# Altium project NXP_FRDM_IMX93.PrjPcb (part 13 of 13)
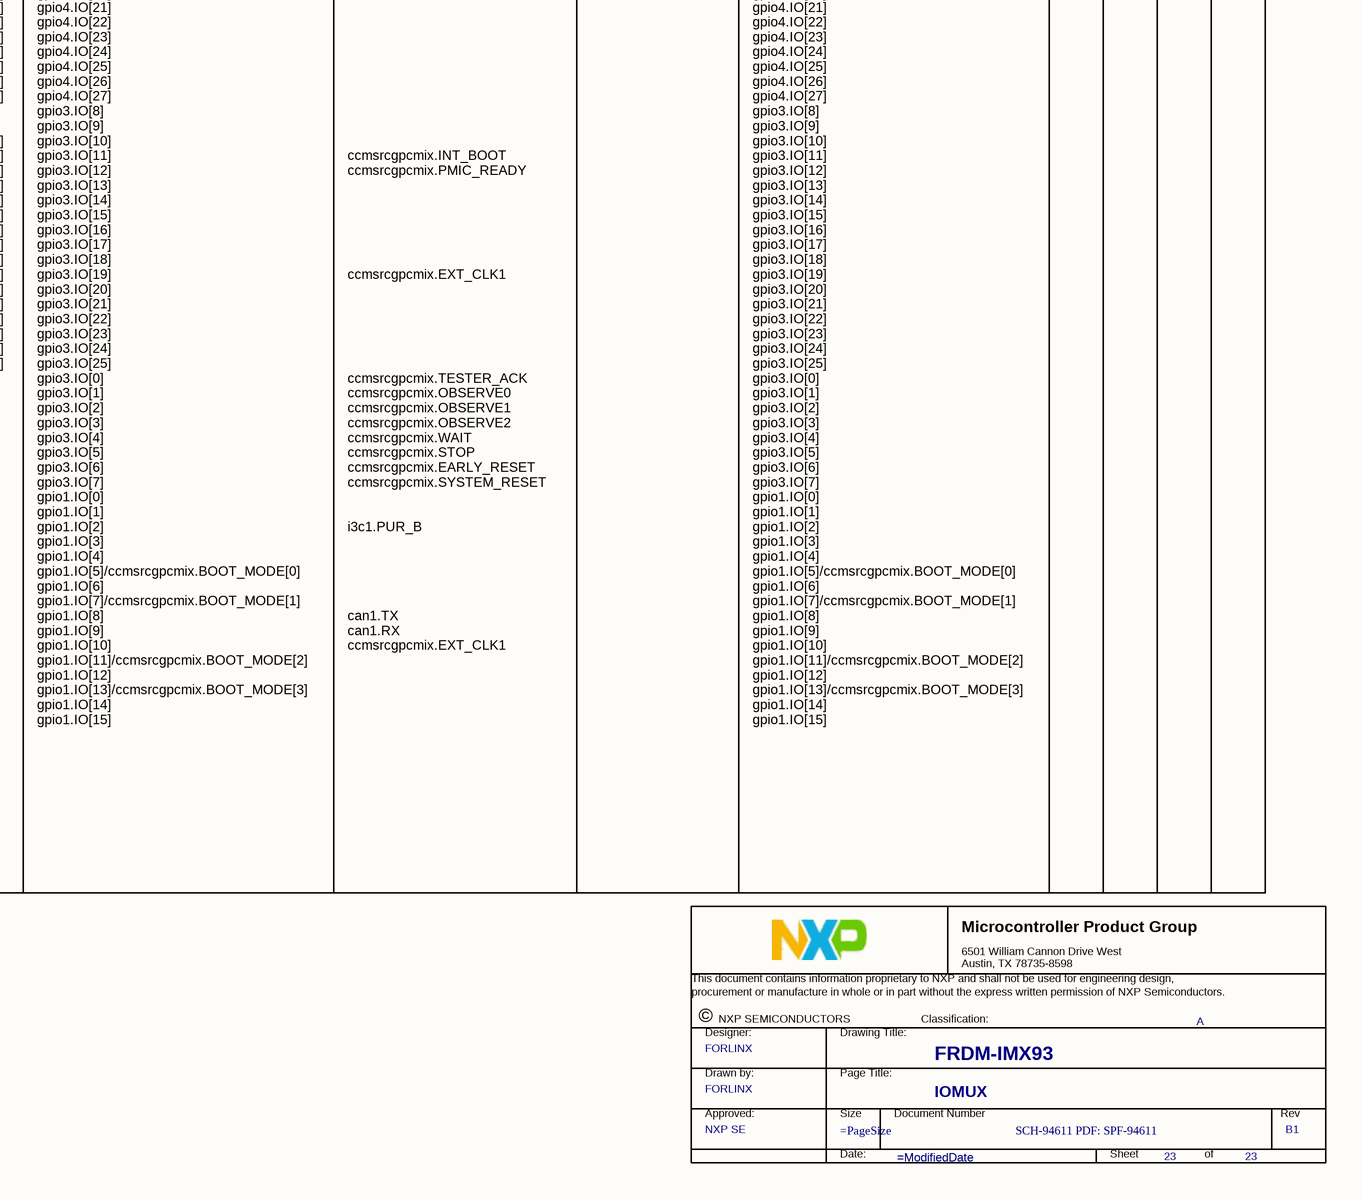
[diagram p45: X-23 IOMUX.SchDoc, bottom right]

## Nets that join several sheets
GND: E-04 CPU PWR (95 pins), E-05 LPDDR4_x (84 pins), E-06 CPU IO_PHY (7 pins), E-07 CPU MISC (15 pins), E-08 eMMC (22 pins), E-09 BOOT_CFG (8 pins), E-10 PMIC (38 pins), E-11 SYS PWR (49 pins), E-12 USB PD (30 pins), E-13 USB2 C (38 pins), E-14 ENET1 (36 pins), E-15 ENET2 (37 pins), E-16 LVDS to HDMI (55 pins), E-17 MIPI DSI_MIPI CSI (44 pins), E-18 M.2 (44 pins), E-19 WIFI_BT_802.15.4 (55 pins), E-20 EXP_MicroSD_ADC (59 pins), E-21 DEBUG_RTC_USB A_CAN (65 pins)
LPD4/x_VDD1: E-04 CPU PWR (6 pins), E-05 LPDDR4_x (14 pins), E-08 eMMC (11 pins), E-10 PMIC (8 pins), E-13 USB2 C (R2660.1), E-14 ENET1 (C868.1 R2686.1 R2691.2), E-15 ENET2 (C882.1 R2707.1 R2713.2), E-16 LVDS to HDMI (6 pins), E-17 MIPI DSI_MIPI CSI (5 pins), E-18 M.2 (12 pins), E-19 WIFI_BT_802.15.4 (16 pins), E-20 EXP_MicroSD_ADC (Q23.1 R3060.1)
LPD4/x_VDD2: E-04 CPU PWR (12 pins), E-05 LPDDR4_x (33 pins), E-10 PMIC (7 pins)
LPD4/x_VDDQ: E-04 CPU PWR (8 pins), E-05 LPDDR4_x (30 pins), E-10 PMIC (R702.2 R704.2 TP702.1 TP1087.1)
NVCC_BBSM_1V8: E-04 CPU PWR (C101.1 U101.G12), E-07 CPU MISC (R401.1 R404.1 R405.1), E-10 PMIC (5 pins)
NVCC_SD: E-04 CPU PWR (C129.1 U101.R16), E-06 CPU IO_PHY (R310.1 R311.1 R312.1), E-10 PMIC (C731.1 TP713.1 TP1095.1 U701.55), E-20 EXP_MicroSD_ADC (R2897.1)
USBC_VBUS_F: E-12 USB PD (D607.A), E-13 USB2 C (18 pins)
VBUS_IN: E-11 SYS PWR (8 pins), E-12 USB PD (C842.1 R2631.2 R2632.2 TP1030.1), E-13 USB2 C (C1016.1 R2939.2 R2940.2)
VDD_3V3: E-04 CPU PWR (7 pins), E-06 CPU IO_PHY (C815.2 R816.1 U10.8), E-08 eMMC (7 pins), E-09 BOOT_CFG (R2581.1 R2582.1 R2583.1 R2584.1), E-10 PMIC (10 pins), E-11 SYS PWR (R2614.1 R2622.1), E-12 USB PD (C846.1 R2638.1 R2642.1 U705.3), E-13 USB2 C (13 pins), E-14 ENET1 (5 pins), E-15 ENET2 (5 pins), E-16 LVDS to HDMI (FB23.1 FB24.1 FB28.1 R2729.2), E-17 MIPI DSI_MIPI CSI (11 pins), E-18 M.2 (9 pins), E-19 WIFI_BT_802.15.4 (C1041.1 C1042.1 U745.1), E-20 EXP_MicroSD_ADC (11 pins), E-21 DEBUG_RTC_USB A_CAN (10 pins)
VDD_5V: E-11 SYS PWR (9 pins), E-12 USB PD (C847.2 U705.12), E-13 USB2 C (C856.2 D624.A U712.12), E-16 LVDS to HDMI (C911.1 C912.1 U722.1), E-17 MIPI DSI_MIPI CSI (C917.1 R2734.2 U723.3), E-18 M.2 (5 pins), E-20 EXP_MicroSD_ADC (9 pins), E-21 DEBUG_RTC_USB A_CAN (7 pins)
VDD_ANA_0V8: E-04 CPU PWR (10 pins), E-10 PMIC (C730.1 TP712.1 TP1094.1 U701.1)
VDD_ANA_1V8: E-04 CPU PWR (17 pins), E-09 BOOT_CFG (R2585.1 R2595.1)
VDD_SOC_0V8: E-04 CPU PWR (26 pins), E-10 PMIC (7 pins)
VLDO3_1V8: E-04 CPU PWR (R111.1), E-10 PMIC (C729.1 TP711.1 TP1093.1 U701.54)
VLDO_3V3: E-12 USB PD (7 pins), E-13 USB2 C (C852.1 C1012.1 U709.A3 U710.A1), E-21 DEBUG_RTC_USB A_CAN (D627.A R2976.1 R2979.1)
VPCIe_3V3: E-18 M.2 (26 pins), E-19 WIFI_BT_802.15.4 (9 pins)
VSYS_5V: E-10 PMIC (21 pins), E-11 SYS PWR (18 pins), E-13 USB2 C (10 pins)
#BOOT_MODE0: E-06 CPU IO_PHY (U101.E21), E-09 BOOT_CFG (R2586.2), E-21 DEBUG_RTC_USB A_CAN (R2973.1)
#BOOT_MODE1: E-06 CPU IO_PHY (U101.F21), E-09 BOOT_CFG (R2587.2), E-21 DEBUG_RTC_USB A_CAN (R2972.1)
#BOOT_MODE2: E-06 CPU IO_PHY (U101.G21), E-09 BOOT_CFG (R2589.2), E-18 M.2 (U728.3)
#BOOT_MODE3: E-06 CPU IO_PHY (U101.H21), E-09 BOOT_CFG (R2590.2), E-18 M.2 (U728.4)
A16_POR_B: E-07 CPU MISC (R406.1), E-10 PMIC (U701.9), E-17 MIPI DSI_MIPI CSI (U743.2)
A17_PMIC_ON_REQ: E-09 BOOT_CFG (R3021.2 R3022.2), E-10 PMIC (R707.1), E-11 SYS PWR (R2613.1 R2945.1)
ADC_IN0: E-07 CPU MISC (U101.B19), E-20 EXP_MicroSD_ADC (P12.3)
ADC_IN1: E-07 CPU MISC (U101.A20), E-20 EXP_MicroSD_ADC (P12.4)
ADC_IN2: E-07 CPU MISC (U101.B20), E-09 BOOT_CFG (R2585.2 R2588.1)
ADC_IN3: E-07 CPU MISC (U101.B21), E-09 BOOT_CFG (R2595.2 R2596.1)
CAN_H: E-20 EXP_MicroSD_ADC (P12.8), E-21 DEBUG_RTC_USB A_CAN (5 pins)
CAN_L: E-20 EXP_MicroSD_ADC (P12.10), E-21 DEBUG_RTC_USB A_CAN (5 pins)
CAN_STBY: E-17 MIPI DSI_MIPI CSI (R2775.2), E-21 DEBUG_RTC_USB A_CAN (R2931.1)
CLKO01: E-07 CPU MISC (U101.AA2), E-18 M.2 (R2851.1 R2854.1 R2862.1)
CLKO02: E-07 CPU MISC (U101.Y3), E-17 MIPI DSI_MIPI CSI (R2754.1)
CLKO03: E-07 CPU MISC (U101.U4), E-17 MIPI DSI_MIPI CSI (R2740.1)
CLKO04: E-07 CPU MISC (U101.V4), E-20 EXP_MicroSD_ADC (Q23.2 R2895.1 R3060.2)
CSI_CLK_N: E-06 CPU IO_PHY (U101.D10), E-17 MIPI DSI_MIPI CSI (P6.8 TP1054.1)
CSI_CLK_P: E-06 CPU IO_PHY (U101.E10), E-17 MIPI DSI_MIPI CSI (P6.9 TP1055.1)
CSI_D0_N: E-06 CPU IO_PHY (U101.A11), E-17 MIPI DSI_MIPI CSI (P6.2 TP1050.1)
CSI_D0_P: E-06 CPU IO_PHY (U101.B11), E-17 MIPI DSI_MIPI CSI (P6.3 TP1051.1)
CSI_D1_N: E-06 CPU IO_PHY (U101.A10), E-17 MIPI DSI_MIPI CSI (P6.5 TP1052.1)
CSI_D1_P: E-06 CPU IO_PHY (U101.B10), E-17 MIPI DSI_MIPI CSI (P6.6 TP1053.1)
DSI_CLK_N: E-06 CPU IO_PHY (U101.D6), E-17 MIPI DSI_MIPI CSI (P7.8 TP1072.1)
DSI_CLK_P: E-06 CPU IO_PHY (U101.E6), E-17 MIPI DSI_MIPI CSI (P7.9 TP1073.1)
DSI_D0_N: E-06 CPU IO_PHY (U101.A6), E-17 MIPI DSI_MIPI CSI (P7.2 TP1068.1)
DSI_D0_P: E-06 CPU IO_PHY (U101.B6), E-17 MIPI DSI_MIPI CSI (P7.3 TP1069.1)
DSI_D1_N: E-06 CPU IO_PHY (U101.A7), E-17 MIPI DSI_MIPI CSI (P7.5 TP1070.1)
DSI_D1_P: E-06 CPU IO_PHY (U101.B7), E-17 MIPI DSI_MIPI CSI (P7.6 TP1071.1)
DSI_D2_N: E-06 CPU IO_PHY (U101.A8), E-17 MIPI DSI_MIPI CSI (P7.11 TP1074.1)
DSI_D2_P: E-06 CPU IO_PHY (U101.B8), E-17 MIPI DSI_MIPI CSI (P7.12 TP1075.1)
DSI_D3_N: E-06 CPU IO_PHY (U101.A9), E-17 MIPI DSI_MIPI CSI (P7.14 TP1076.1)
DSI_D3_P: E-06 CPU IO_PHY (U101.B9), E-17 MIPI DSI_MIPI CSI (P7.15 TP1077.1)
E14_USB2_VBUS_3V3: E-06 CPU IO_PHY (R304.2), E-21 DEBUG_RTC_USB A_CAN (R2916.1)
ENET1_MDC: E-06 CPU IO_PHY (U101.AA11), E-14 ENET1 (U713.14)
ENET1_MDIO: E-06 CPU IO_PHY (U101.AA10), E-14 ENET1 (R2691.1 U713.15)
ENET1_MODE0: E-06 CPU IO_PHY (U101.Y9), E-14 ENET1 (R2692.1 U713.25)
ENET1_MODE1: E-06 CPU IO_PHY (U101.AA9), E-14 ENET1 (R2693.1 U713.24)
ENET1_MODE2: E-06 CPU IO_PHY (U101.Y10), E-14 ENET1 (R2694.1 U713.23)
ENET1_nINT: E-14 ENET1 (R3046.1 R3047.1), E-17 MIPI DSI_MIPI CSI (R3053.2)
ENET1_nRST: E-14 ENET1 (R3045.1 R3048.1), E-17 MIPI DSI_MIPI CSI (R2766.2)
ENET1_PHYAD1: E-06 CPU IO_PHY (U101.AA7), E-14 ENET1 (R2689.1 U713.28)
ENET1_PHYAD2: E-06 CPU IO_PHY (U101.Y8), E-14 ENET1 (R2690.1 U713.27)
ENET1_RD0: E-06 CPU IO_PHY (U101.AA8), E-14 ENET1 (R2696.1 U713.26)
ENET1_TD0: E-06 CPU IO_PHY (U101.W11), E-14 ENET1 (U713.19)
ENET1_TD1: E-06 CPU IO_PHY (U101.T12), E-14 ENET1 (U713.18)
ENET1_TD2: E-06 CPU IO_PHY (U101.U12), E-14 ENET1 (U713.17)
ENET1_TD3: E-06 CPU IO_PHY (U101.V12), E-14 ENET1 (U713.16)
ENET1_TX_CTL: E-06 CPU IO_PHY (U101.V10), E-14 ENET1 (U713.20)
ENET1_TXC: E-06 CPU IO_PHY (U101.U10), E-14 ENET1 (U713.21)
ENET2_MDC: E-06 CPU IO_PHY (U101.Y7), E-15 ENET2 (U716.14)
ENET2_MDIO: E-06 CPU IO_PHY (U101.AA6), E-15 ENET2 (R2713.1 U716.15)
ENET2_MODE0: E-06 CPU IO_PHY (U101.Y5), E-15 ENET2 (R2714.1 U716.25)
ENET2_MODE1: E-06 CPU IO_PHY (U101.AA5), E-15 ENET2 (R2715.1 U716.24)
ENET2_MODE2: E-06 CPU IO_PHY (U101.Y6), E-15 ENET2 (R2716.1 U716.23)
ENET2_nINT: E-15 ENET2 (R3049.1 R3051.1), E-17 MIPI DSI_MIPI CSI (R3054.2)
ENET2_nRST: E-15 ENET2 (R3050.1 R3052.1), E-17 MIPI DSI_MIPI CSI (R2770.2)
ENET2_PHYAD1: E-06 CPU IO_PHY (U101.AA3), E-15 ENET2 (R2710.1 R2711.1 U716.28)
ENET2_PHYAD2: E-06 CPU IO_PHY (U101.Y4), E-15 ENET2 (R2712.1 U716.27)
ENET2_RD0: E-06 CPU IO_PHY (U101.AA4), E-15 ENET2 (R2718.1 U716.26)
ENET2_TD0: E-06 CPU IO_PHY (U101.T8), E-15 ENET2 (U716.19)
ENET2_TD1: E-06 CPU IO_PHY (U101.U8), E-15 ENET2 (U716.18)
ENET2_TD2: E-06 CPU IO_PHY (U101.V8), E-15 ENET2 (U716.17)
ENET2_TD3: E-06 CPU IO_PHY (U101.T10), E-15 ENET2 (U716.16)
ENET2_TX_CTL: E-06 CPU IO_PHY (U101.V6), E-15 ENET2 (U716.20)
ENET2_TXC: E-06 CPU IO_PHY (U101.U6), E-15 ENET2 (U716.21)
EXP_BTN1: E-11 SYS PWR (R2608.2 TP1039.1), E-17 MIPI DSI_MIPI CSI (R2752.2 R3057.2)
EXP_BTN2: E-11 SYS PWR (R2610.2 TP1040.1), E-17 MIPI DSI_MIPI CSI (R2755.2 R3058.2)
EXP_GPIO_IO00: E-06 CPU IO_PHY (U101.J21), E-20 EXP_MicroSD_ADC (P11.27)
EXP_GPIO_IO01: E-06 CPU IO_PHY (U101.J20), E-20 EXP_MicroSD_ADC (P11.28)
EXP_GPIO_IO02: E-13 USB2 C (R2668.2), E-20 EXP_MicroSD_ADC (P11.3)
EXP_GPIO_IO03: E-13 USB2 C (R2672.2), E-20 EXP_MicroSD_ADC (P11.5)
EXP_GPIO_IO04: E-06 CPU IO_PHY (U101.L17), E-11 SYS PWR (R2627.1), E-20 EXP_MicroSD_ADC (P11.7)
EXP_GPIO_IO05: E-06 CPU IO_PHY (U101.L18), E-20 EXP_MicroSD_ADC (P11.29)
EXP_GPIO_IO06: E-06 CPU IO_PHY (U101.L20), E-20 EXP_MicroSD_ADC (P11.31)
EXP_GPIO_IO07: E-06 CPU IO_PHY (U101.L21), E-20 EXP_MicroSD_ADC (P11.26)
EXP_GPIO_IO08: E-18 M.2 (R2811.2), E-20 EXP_MicroSD_ADC (P11.24)
EXP_GPIO_IO09: E-18 M.2 (R2814.2), E-20 EXP_MicroSD_ADC (P11.21)
EXP_GPIO_IO10: E-18 M.2 (R2816.2), E-20 EXP_MicroSD_ADC (P11.19)
EXP_GPIO_IO11: E-18 M.2 (R2818.2), E-20 EXP_MicroSD_ADC (P11.23)
EXP_GPIO_IO12: E-06 CPU IO_PHY (U101.N20), E-11 SYS PWR (R2629.1), E-20 EXP_MicroSD_ADC (P11.32)
EXP_GPIO_IO13: E-06 CPU IO_PHY (U101.N21), E-11 SYS PWR (R2623.1), E-20 EXP_MicroSD_ADC (P11.33)
EXP_GPIO_IO14: E-06 CPU IO_PHY (U101.P20), E-20 EXP_MicroSD_ADC (P11.8)
EXP_GPIO_IO15: E-06 CPU IO_PHY (U101.P21), E-20 EXP_MicroSD_ADC (P11.10)
EXP_GPIO_IO16: E-06 CPU IO_PHY (U101.R21), E-20 EXP_MicroSD_ADC (P11.36)
EXP_GPIO_IO17: E-06 CPU IO_PHY (U101.R20), E-20 EXP_MicroSD_ADC (P11.11)
EXP_GPIO_IO18: E-06 CPU IO_PHY (U101.R18), E-20 EXP_MicroSD_ADC (P11.12)
EXP_GPIO_IO19: E-06 CPU IO_PHY (U101.R17), E-20 EXP_MicroSD_ADC (P11.35)
EXP_GPIO_IO20: E-06 CPU IO_PHY (U101.T20), E-20 EXP_MicroSD_ADC (P11.38)
EXP_GPIO_IO21: E-06 CPU IO_PHY (U101.T21), E-20 EXP_MicroSD_ADC (P11.40)
EXP_GPIO_IO22: E-06 CPU IO_PHY (U101.U18), E-20 EXP_MicroSD_ADC (P11.15)
EXP_GPIO_IO23: E-06 CPU IO_PHY (U101.U20), E-11 SYS PWR (R2611.2), E-20 EXP_MicroSD_ADC (P11.16)
EXP_GPIO_IO24: E-06 CPU IO_PHY (U101.U21), E-11 SYS PWR (R2612.2), E-20 EXP_MicroSD_ADC (P11.18)
EXP_GPIO_IO25: E-06 CPU IO_PHY (U101.V21), E-20 EXP_MicroSD_ADC (P11.22), E-21 DEBUG_RTC_USB A_CAN (SW3.1 TP1083.1)
EXP_GPIO_IO26: E-06 CPU IO_PHY (U101.V20), E-20 EXP_MicroSD_ADC (P11.37)
EXP_GPIO_IO27: E-06 CPU IO_PHY (U101.W21), E-20 EXP_MicroSD_ADC (P11.13), E-21 DEBUG_RTC_USB A_CAN (SW3.2 TP1084.1)
EXP_PWREN: E-17 MIPI DSI_MIPI CSI (R2757.2), E-20 EXP_MicroSD_ADC (R2892.1 R3016.1)
EXT1_PWREN: E-17 MIPI DSI_MIPI CSI (R2762.2), E-18 M.2 (R2781.1), E-20 EXP_MicroSD_ADC (R2894.1)
F12_USB1_VBUS_3V3: E-06 CPU IO_PHY (R301.2), E-13 USB2 C (R2650.2 U708.1)
GPIO_IO02: E-06 CPU IO_PHY (U101.K20), E-13 USB2 C (R2667.2 R2668.1)
GPIO_IO03: E-06 CPU IO_PHY (U101.K21), E-13 USB2 C (R2671.2 R2672.1)
GPIO_IO08: E-06 CPU IO_PHY (U101.M20), E-18 M.2 (R2810.2 R2811.1)
GPIO_IO09: E-06 CPU IO_PHY (U101.M21), E-18 M.2 (R2813.2 R2814.1)
GPIO_IO10: E-06 CPU IO_PHY (U101.N17), E-18 M.2 (R2815.2 R2816.1)
GPIO_IO11: E-06 CPU IO_PHY (U101.N18), E-18 M.2 (R2817.2 R2818.1)
GPIO_IO28: E-06 CPU IO_PHY (U101.W20), E-13 USB2 C (R2988.1)
GPIO_IO29: E-06 CPU IO_PHY (U101.Y21), E-13 USB2 C (R2990.1)
I2C1_SCL: E-06 CPU IO_PHY (U101.C20), E-10 PMIC (R2569.1), E-13 USB2 C (5 pins), E-16 LVDS to HDMI (R2725.2), E-17 MIPI DSI_MIPI CSI (R2767.1)
I2C1_SDA: E-06 CPU IO_PHY (U101.C21), E-10 PMIC (R2570.1), E-13 USB2 C (5 pins), E-16 LVDS to HDMI (R2726.2), E-17 MIPI DSI_MIPI CSI (R2769.1)
I2C2_SCL: E-06 CPU IO_PHY (R2579.2 U101.D20), E-10 PMIC (R714.1), E-13 USB2 C (R2665.2), E-17 MIPI DSI_MIPI CSI (R2763.1)
I2C2_SDA: E-06 CPU IO_PHY (R2580.2 U101.D21), E-10 PMIC (R715.1), E-13 USB2 C (R2669.2), E-17 MIPI DSI_MIPI CSI (R2761.1)
I2C4_SCL: E-13 USB2 C (R2671.1 R2673.1 R2677.1), E-16 LVDS to HDMI (R2996.2)
I2C4_SDA: E-13 USB2 C (R2667.1 R2670.1 R2675.1), E-16 LVDS to HDMI (R2997.2)
I3C1_SCL: E-13 USB2 C (R3001.2), E-20 EXP_MicroSD_ADC (R2906.1)
I3C1_SDA: E-13 USB2 C (R3000.2), E-20 EXP_MicroSD_ADC (R2907.1)
JTAG_TCK: E-07 CPU MISC (R403.1 U101.Y1), E-18 M.2 (R3018.1), E-20 EXP_MicroSD_ADC (P14.1)
JTAG_TDI: E-07 CPU MISC (U101.W1), E-18 M.2 (R2841.1)
JTAG_TDO: E-07 CPU MISC (U101.Y2), E-18 M.2 (R2830.1)
JTAG_TMS: E-07 CPU MISC (U101.W2), E-18 M.2 (R3017.1), E-19 WIFI_BT_802.15.4 (TP936.1 U731.J5), E-20 EXP_MicroSD_ADC (P14.2)
LVDS_CLK_N: E-06 CPU IO_PHY (U101.A3), E-16 LVDS to HDMI (U719.25)
LVDS_CLK_P: E-06 CPU IO_PHY (U101.B3), E-16 LVDS to HDMI (U719.26)
LVDS_nRST: E-16 LVDS to HDMI (R2731.2), E-17 MIPI DSI_MIPI CSI (R3032.2)
LVDS_TX0_N: E-06 CPU IO_PHY (U101.A5), E-16 LVDS to HDMI (U719.18)
LVDS_TX0_P: E-06 CPU IO_PHY (U101.B5), E-16 LVDS to HDMI (U719.19)
LVDS_TX1_N: E-06 CPU IO_PHY (U101.A4), E-16 LVDS to HDMI (U719.20)
LVDS_TX1_P: E-06 CPU IO_PHY (U101.B4), E-16 LVDS to HDMI (U719.21)
LVDS_TX2_N: E-06 CPU IO_PHY (U101.A2), E-16 LVDS to HDMI (U719.23)
LVDS_TX2_P: E-06 CPU IO_PHY (U101.B2), E-16 LVDS to HDMI (U719.24)
LVDS_TX3_N: E-06 CPU IO_PHY (U101.B1), E-16 LVDS to HDMI (U719.28)
LVDS_TX3_P: E-06 CPU IO_PHY (U101.C1), E-16 LVDS to HDMI (U719.29)
M2_nALERT: E-17 MIPI DSI_MIPI CSI (R2759.2), E-18 M.2 (Q16.3 R2873.2)
M2_nDIS1: E-17 MIPI DSI_MIPI CSI (R2773.2), E-18 M.2 (R2782.1 R2866.1 R2870.1)
M2_nDIS2: E-17 MIPI DSI_MIPI CSI (R2774.2), E-18 M.2 (Q17.1 R2867.1 R2871.1 R2955.1)
M2_nRST: E-17 MIPI DSI_MIPI CSI (R2772.2), E-18 M.2 (R2865.2)
ONOFF: E-07 CPU MISC (C814.1 R405.2 U101.A19), E-09 BOOT_CFG (D629.C), E-11 SYS PWR (C826.1 D602.1 K1.3 TP1041.1)
PCIE_nWAKE: E-17 MIPI DSI_MIPI CSI (R2749.2), E-18 M.2 (R2868.1), E-20 EXP_MicroSD_ADC (R2888.1)
PDM_CLK: E-06 CPU IO_PHY (U101.G17), E-20 EXP_MicroSD_ADC (R2912.1)
PDM_DATA0: E-06 CPU IO_PHY (U101.J17), E-20 EXP_MicroSD_ADC (R2910.1)
PDM_DATA1: E-06 CPU IO_PHY (R806.2 U101.G18), E-11 SYS PWR (U746.1)
PMIC_32K_OUT: E-07 CPU MISC (R411.1), E-10 PMIC (U701.7), E-18 M.2 (R2858.2)
PMIC_nINT: E-06 CPU IO_PHY (R806.1), E-10 PMIC (U701.13), E-17 MIPI DSI_MIPI CSI (R2758.2 R2760.2)
PMIC_ON_REQ: E-07 CPU MISC (R401.2 R418.1 U101.A17), E-09 BOOT_CFG (C1045.1 Q21.2 R3020.1 R3021.1)
PMIC_SCLL: E-10 PMIC (R712.2 U701.27), E-18 M.2 (R2857.2), E-19 WIFI_BT_802.15.4 (R3024.1)
PMIC_SDAL: E-10 PMIC (R713.2 U701.26), E-18 M.2 (R2856.2), E-19 WIFI_BT_802.15.4 (R3023.1)
PMIC_STBY_REQ: E-07 CPU MISC (R417.1 U101.B18), E-10 PMIC (R708.1), E-11 SYS PWR (U747.1)
RTC_CLK: E-18 M.2 (R2863.2), E-21 DEBUG_RTC_USB A_CAN (U740.6)
RTC_nINTA: E-17 MIPI DSI_MIPI CSI (R2750.2), E-21 DEBUG_RTC_USB A_CAN (R2984.1 R2986.1 U740.13)
SAI1_RXD0: E-06 CPU IO_PHY (U101.H20), E-18 M.2 (U728.5)
SAI1_TXC: E-06 CPU IO_PHY (U101.G20), E-18 M.2 (U728.2)
SD1_CLK: E-06 CPU IO_PHY (U101.Y11), E-08 eMMC (R803.1)
SD1_CMD: E-06 CPU IO_PHY (U101.AA12), E-08 eMMC (R502.2 U501.M5)
SD1_DATA0: E-06 CPU IO_PHY (U101.AA14), E-08 eMMC (R501.2 U501.A3)
SD1_DATA1: E-06 CPU IO_PHY (U101.AA15), E-08 eMMC (U501.A4)
SD1_DATA2: E-06 CPU IO_PHY (U101.AA16), E-08 eMMC (U501.A5)
SD1_DATA3: E-06 CPU IO_PHY (U101.AA13), E-08 eMMC (U501.B2)
SD1_DATA4: E-06 CPU IO_PHY (U101.Y13), E-08 eMMC (U501.B3)
SD1_DATA5: E-06 CPU IO_PHY (U101.Y14), E-08 eMMC (U501.B4)
SD1_DATA6: E-06 CPU IO_PHY (U101.Y15), E-08 eMMC (U501.B5)
SD1_DATA7: E-06 CPU IO_PHY (U101.Y16), E-08 eMMC (U501.B6)
SD1_STROBE: E-06 CPU IO_PHY (U101.Y12), E-08 eMMC (R822.2 U501.H5)
SD2_CLK: E-06 CPU IO_PHY (U101.AA19), E-20 EXP_MicroSD_ADC (R2898.1 R2901.1)
SD2_CMD: E-06 CPU IO_PHY (R311.2 U101.Y19), E-20 EXP_MicroSD_ADC (R2900.1)
SD2_DATA0: E-06 CPU IO_PHY (R310.2 U101.Y18), E-20 EXP_MicroSD_ADC (R2902.1)
SD2_DATA1: E-06 CPU IO_PHY (U101.AA18), E-20 EXP_MicroSD_ADC (R2904.1)
SD2_DATA2: E-06 CPU IO_PHY (U101.Y20), E-20 EXP_MicroSD_ADC (R2903.1)
SD2_DATA3: E-06 CPU IO_PHY (U101.AA20), E-20 EXP_MicroSD_ADC (R2905.1)
SD2_nCD: E-06 CPU IO_PHY (U101.Y17), E-20 EXP_MicroSD_ADC (R2896.1 R2897.2 R2899.1)
SD2_RESET_B: E-06 CPU IO_PHY (R312.2 U101.AA17), E-10 PMIC (R723.2)
SD2_VSEL: E-06 CPU IO_PHY (U101.V18), E-10 PMIC (R812.1 U701.29)
SD3_CLK: E-06 CPU IO_PHY (U101.V16), E-18 M.2 (R2808.1 R2824.1)
SD3_CMD: E-06 CPU IO_PHY (U101.U16), E-18 M.2 (R2809.1 R2825.1)
SD3_DATA0: E-06 CPU IO_PHY (U101.T16), E-18 M.2 (R2812.1 R2826.1)
SD3_DATA1: E-06 CPU IO_PHY (U101.V14), E-18 M.2 (R2819.1 R2827.1)
SD3_DATA2: E-06 CPU IO_PHY (U101.U14), E-18 M.2 (R2820.1 R2828.1)
SD3_DATA3: E-06 CPU IO_PHY (U101.T14), E-18 M.2 (R2821.1 R2829.1)
SD3_nRST: E-17 MIPI DSI_MIPI CSI (R2764.2 R2768.1), E-18 M.2 (R3037.1 R3038.1)
SPI3_SW_EN: E-18 M.2 (R2961.1), E-19 WIFI_BT_802.15.4 (U748.2)
SYS_nRST: E-10 PMIC (R706.1 TP915.1), E-21 DEBUG_RTC_USB A_CAN (C1037.2 D628.1 P19.1 R2987.2)
TCPC1_nINT: E-13 USB2 C (R2661.2 U712.10), E-17 MIPI DSI_MIPI CSI (R2756.1)
TCPC_nINT: E-12 USB PD (R2642.2 TP926.1 U705.10), E-17 MIPI DSI_MIPI CSI (R2748.2)
UART1_RXD: E-06 CPU IO_PHY (U101.E20), E-21 DEBUG_RTC_USB A_CAN (R2975.1)
UART2_RXD: E-06 CPU IO_PHY (U101.F20), E-21 DEBUG_RTC_USB A_CAN (R2974.1)
UART_nWAKE: E-17 MIPI DSI_MIPI CSI (R2751.2), E-18 M.2 (R2853.1 R2855.1 R2859.1)
USB1_DM: E-06 CPU IO_PHY (U101.A14), E-13 USB2 C (U711.C1)
USB1_DP: E-06 CPU IO_PHY (U101.B14), E-13 USB2 C (U711.C2)
USB1_ID: E-06 CPU IO_PHY (U101.C11), E-13 USB2 C (R2660.2)
USB2_DN: E-06 CPU IO_PHY (U101.A15), E-18 M.2 (R2804.1 R2807.1)
USB2_DP: E-06 CPU IO_PHY (U101.B15), E-18 M.2 (R2803.1 R2806.1)
USB2_HOST_DN: E-18 M.2 (R2804.2), E-21 DEBUG_RTC_USB A_CAN (U735.C1)
USB2_HOST_DP: E-18 M.2 (R2803.2), E-21 DEBUG_RTC_USB A_CAN (U735.C2)
USB2_ID: E-06 CPU IO_PHY (U101.E12), E-21 DEBUG_RTC_USB A_CAN (R2917.1)
USB_I2C_SCL: E-12 USB PD (R2643.2), E-13 USB2 C (5 pins), E-17 MIPI DSI_MIPI CSI (R2742.1 R2743.1 TP1060.1), E-21 DEBUG_RTC_USB A_CAN (R2923.1)
USB_I2C_SDA: E-12 USB PD (R2644.2), E-13 USB2 C (5 pins), E-17 MIPI DSI_MIPI CSI (R2741.1 R2744.1 TP1061.1), E-21 DEBUG_RTC_USB A_CAN (R2922.1)
VSD_3V3: E-10 PMIC (C725.1 U701.23), E-20 EXP_MicroSD_ADC (C986.1 C987.1 D615.1 P13.4)
W2_BT_154_RST: E-18 M.2 (R2871.2), E-19 WIFI_BT_802.15.4 (U745.3)
W2_BT_154_WAKE_HOST: E-18 M.2 (R2855.2), E-19 WIFI_BT_802.15.4 (U745.5)
W2_nDIS1: E-18 M.2 (R2870.2), E-19 WIFI_BT_802.15.4 (U745.2)
W2_PCM_CLK: E-18 M.2 (R2796.2), E-19 WIFI_BT_802.15.4 (U731.D8)
W2_PCM_DIN: E-18 M.2 (R2802.2), E-19 WIFI_BT_802.15.4 (U731.F9)
W2_PCM_DOUT: E-18 M.2 (R2800.2), E-19 WIFI_BT_802.15.4 (U731.E9)
W2_PCM_SYNC: E-18 M.2 (R2798.2), E-19 WIFI_BT_802.15.4 (U731.F8)
W2_SD_CLK: E-18 M.2 (R2808.2), E-19 WIFI_BT_802.15.4 (U731.A4)
W2_SD_CMD: E-18 M.2 (R2809.2), E-19 WIFI_BT_802.15.4 (U731.B4)
W2_SD_DAT0: E-18 M.2 (R2812.2), E-19 WIFI_BT_802.15.4 (U731.B3)
W2_SD_DAT1: E-18 M.2 (R2819.2), E-19 WIFI_BT_802.15.4 (U731.A3)
W2_SD_DAT2: E-18 M.2 (R2820.2), E-19 WIFI_BT_802.15.4 (U731.B5)
W2_SD_DAT3: E-18 M.2 (R2821.2), E-19 WIFI_BT_802.15.4 (U731.A5)
W2_SPI_CLK: E-18 M.2 (R2801.2), E-19 WIFI_BT_802.15.4 (U731.E2)
W2_SPI_FRM: E-18 M.2 (R2797.2), E-19 WIFI_BT_802.15.4 (U731.C2)
W2_SPI_nINT: E-18 M.2 (R3028.1), E-19 WIFI_BT_802.15.4 (U731.D2)
W2_SPI_RX: E-18 M.2 (R2805.2), E-19 WIFI_BT_802.15.4 (U731.F2)
W2_SPI_TX: E-18 M.2 (R2799.2), E-19 WIFI_BT_802.15.4 (U731.G2)
W2_UART_CTS: E-18 M.2 (R2838.1), E-19 WIFI_BT_802.15.4 (U731.H9)
W2_UART_RTS: E-18 M.2 (R2836.1), E-19 WIFI_BT_802.15.4 (U731.H8)
W2_UART_RX: E-18 M.2 (R2834.1), E-19 WIFI_BT_802.15.4 (U731.G9)
W2_UART_TX: E-18 M.2 (R2832.1), E-19 WIFI_BT_802.15.4 (U731.G8)
WDOG_B: E-06 CPU IO_PHY (U101.J18), E-10 PMIC (R710.1 TP916.1)
WL_RST: E-18 M.2 (R3038.2), E-19 WIFI_BT_802.15.4 (U731.H7)
WL_WAKE_HOST: E-18 M.2 (R2854.2), E-19 WIFI_BT_802.15.4 (U731.F7)